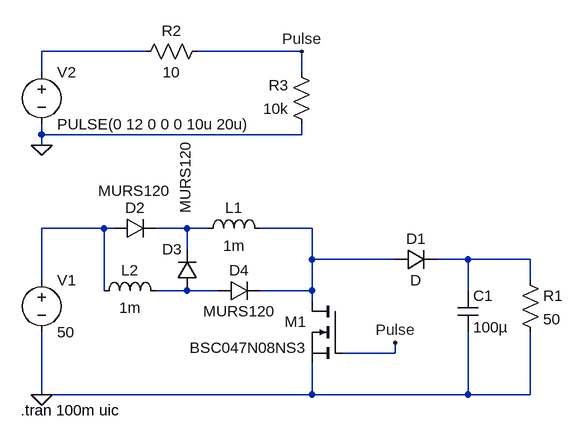
[diagram p0: schematic Voltage_Lift.asc]
Voltage_Lift.asc, the LTspice schematic file:
Version 4
SHEET 1 880 680
WIRE -96 -256 -256 -256
WIRE 144 -256 -16 -256
WIRE -256 -224 -256 -256
WIRE 144 -224 144 -256
WIRE -256 -128 -256 -144
WIRE 144 -128 144 -144
WIRE 144 -128 -256 -128
WIRE -256 -112 -256 -128
WIRE -160 16 -256 16
WIRE -144 16 -160 16
WIRE -32 16 -80 16
WIRE 0 16 -32 16
WIRE 160 16 80 16
WIRE -32 48 -32 16
WIRE 160 64 160 16
WIRE 288 64 160 64
WIRE 400 64 352 64
WIRE 496 64 400 64
WIRE -256 96 -256 16
WIRE 496 96 496 64
WIRE -160 112 -160 16
WIRE -32 112 -80 112
WIRE 16 112 -32 112
WIRE 160 112 160 64
WIRE 160 112 80 112
WIRE 400 112 400 64
WIRE 160 128 160 112
WIRE 288 208 288 192
WIRE 288 208 208 208
WIRE -256 272 -256 176
WIRE 160 272 160 224
WIRE 160 272 -256 272
WIRE 400 272 400 176
WIRE 400 272 160 272
WIRE 496 272 496 176
WIRE 496 272 400 272
FLAG 288 192 Pulse
FLAG -256 272 0
FLAG -256 -112 0
FLAG 144 -256 Pulse
SYMBOL voltage -256 80 R0
WINDOW 123 0 0 Left 0
WINDOW 39 0 0 Left 0
SYMATTR InstName V1
SYMATTR Value 50
SYMBOL nmos 208 128 M0
SYMATTR InstName M1
SYMATTR Value BSC047N08NS3
SYMBOL diode 288 80 R270
WINDOW 0 32 32 VTop 2
WINDOW 3 0 32 VBottom 2
SYMATTR InstName D1
SYMBOL cap 384 112 R0
SYMATTR InstName C1
SYMATTR Value 100µ
SYMBOL res 480 80 R0
SYMATTR InstName R1
SYMATTR Value 50
SYMBOL diode -144 32 R270
WINDOW 0 32 32 VTop 2
WINDOW 3 89 31 VBottom 2
SYMATTR InstName D2
SYMATTR Value MURS120
SYMBOL ind -16 32 R270
WINDOW 0 32 56 VTop 2
WINDOW 3 5 56 VBottom 2
SYMATTR InstName L1
SYMATTR Value 1m
SYMBOL ind -176 128 R270
WINDOW 0 32 56 VTop 2
WINDOW 3 5 56 VBottom 2
SYMATTR InstName L2
SYMATTR Value 1m
SYMBOL voltage -256 -240 R0
WINDOW 123 0 0 Left 0
WINDOW 39 0 0 Left 0
SYMATTR InstName V2
SYMATTR Value PULSE(0 12 0 0 0 10u 20u)
SYMBOL res 0 -272 R90
WINDOW 0 0 56 VBottom 2
WINDOW 3 32 56 VTop 2
SYMATTR InstName R2
SYMATTR Value 10
SYMBOL res 160 -128 R180
WINDOW 0 36 76 Left 2
WINDOW 3 36 40 Left 2
SYMATTR InstName R3
SYMATTR Value 10k
SYMBOL diode -16 112 R180
WINDOW 0 24 64 Left 2
WINDOW 3 19 119 VRight 2
SYMATTR InstName D3
SYMATTR Value MURS120
SYMBOL diode 16 128 R270
WINDOW 0 32 32 VTop 2
WINDOW 3 0 32 VBottom 2
SYMATTR InstName D4
SYMATTR Value MURS120
TEXT -288 296 Left 2 !.tran 100m uic

The netlist it stands for:
* Voltage_Lift.asc
V1 N002 0 50
M1 N004 Pulse 0 0 BSC047N08NS3
D1 N004 N005 D
C1 N005 0 100µ
R1 N005 0 50
D2 N002 N003 MURS120
L1 N003 N004 1m
L2 N002 N006 1m
V2 N001 0 PULSE(0 12 0 0 0 10u 20u)
R2 Pulse N001 10
R3 0 Pulse 10k
D3 N006 N003 MURS120
D4 N006 N004 MURS120
.model D D
.lib standard.dio
.model NMOS NMOS
.model PMOS PMOS
.lib standard.mos
.tran 100m uic
.backanno
.end